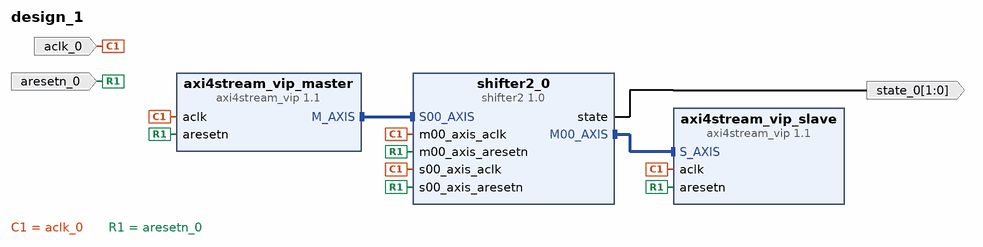
[diagram p0: block diagram of the top level]
# Vivado block design design_1, xc7z020clg400-1, Vivado 2019.2
create_bd_design design_1

create_bd_port -dir I -type clk aclk_0
create_bd_port -dir I -type rst aresetn_0
create_bd_port -dir O -from 1 -to 0 state_0

create_bd_cell -type ip -vlnv xilinx.com:user:shifter2:1.0 shifter2_0
create_bd_cell -type ip -vlnv xilinx.com:ip:axi4stream_vip:1.1 axi4stream_vip_master
set_property -dict [list \
  CONFIG.HAS_TKEEP 0 \
  CONFIG.HAS_TLAST 1 \
  CONFIG.HAS_TREADY 1 \
  CONFIG.HAS_TSTRB 1 \
  CONFIG.INTERFACE_MODE MASTER \
  CONFIG.TDATA_NUM_BYTES 4 \
  CONFIG.TDEST_WIDTH 0 \
  CONFIG.TID_WIDTH 0 \
  CONFIG.TUSER_WIDTH 0 \
] [get_bd_cells axi4stream_vip_master]
create_bd_cell -type ip -vlnv xilinx.com:ip:axi4stream_vip:1.1 axi4stream_vip_slave
set_property -dict {CONFIG.INTERFACE_MODE SLAVE} [get_bd_cells axi4stream_vip_slave]

# ---- connections ----

connect_bd_intf_net -intf_net axi4stream_vip_0_M_AXIS [get_bd_intf_pins axi4stream_vip_master/M_AXIS] [get_bd_intf_pins shifter2_0/S00_AXIS]
connect_bd_intf_net [get_bd_intf_pins axi4stream_vip_slave/S_AXIS] [get_bd_intf_pins shifter2_0/M00_AXIS]
connect_bd_net -net aclk_0_1 [get_bd_ports aclk_0] \
  [get_bd_pins axi4stream_vip_master/aclk] [get_bd_pins shifter2_0/s00_axis_aclk] [get_bd_pins shifter2_0/m00_axis_aclk] \
  [get_bd_pins axi4stream_vip_slave/aclk]
connect_bd_net -net aresetn_0_1 [get_bd_ports aresetn_0] \
  [get_bd_pins axi4stream_vip_master/aresetn] [get_bd_pins shifter2_0/m00_axis_aresetn] \
  [get_bd_pins shifter2_0/s00_axis_aresetn] [get_bd_pins axi4stream_vip_slave/aresetn]
connect_bd_net [get_bd_pins shifter2_0/state] [get_bd_ports state_0]

validate_bd_design
save_bd_design
